# Altium schematic sheet Accelerometer.SchDoc
size 420 x 297 mm; SheetNumber: 2; SheetTotal: 14; PageSetup: Record=PageOptions|CenterHorizontal=True|CenterVertical=True|PrintScale=0.96|XCorrection=1.00|YCorrection=1.00|PrintKind=1|BorderSize=5000000|LeftOffset=0|BottomOffset=0|Orientation=2|PaperLength=4318|PaperWidth=2794|Scale=100|PaperSource=7|PrintQuality=600|MediaType=1|DitherType=10|PaperKind=11" x 17"|PrintScaleMode=1
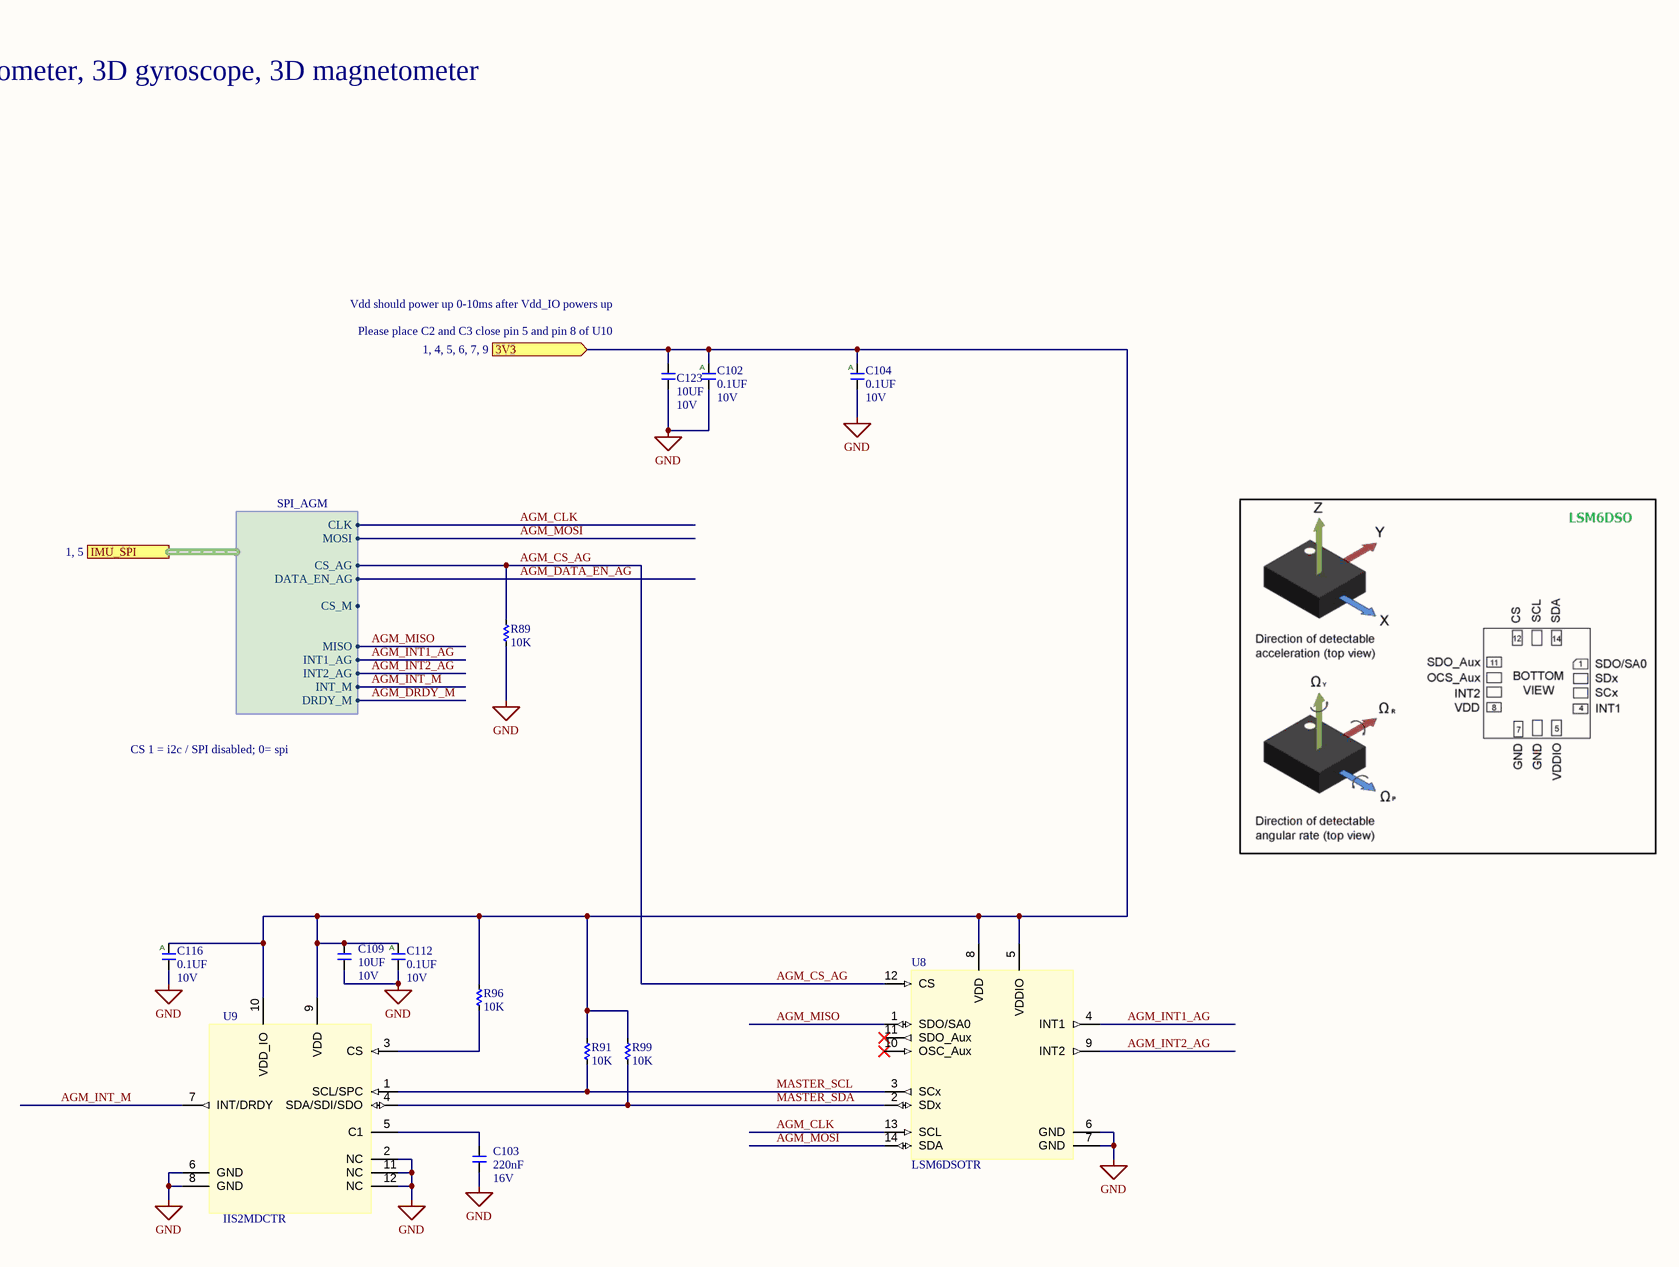
[diagram p0: Accelerometer.SchDoc]

## Parts
C102  value 0.1UF  Voltage: 10V  [C0201]  (hidden comment: __Template_Cap_Auto)
C103  value 220nF  Voltage: 16V  [C0402]  (hidden comment: __Template_Cap)
C104  value 0.1UF  Voltage: 10V  [C0201]  (hidden comment: __Template_Cap_Auto)
C109  value 10UF  Voltage: 10V  [C0402]  (hidden comment: __Template_Cap)
C112  value 0.1UF  Voltage: 10V  [C0201]  (hidden comment: __Template_Cap_Auto)
C116  value 0.1UF  Voltage: 10V  [C0201]  (hidden comment: __Template_Cap_Auto)
C123  value 10UF  Voltage: 10V  [C0402]  (hidden comment: __Template_Cap)
R89  value 10K  [R0201]  (hidden comment: __Template_Resistor)
R91  value 10K  [R0201]  (hidden comment: __Template_Resistor)
R96  value 10K  [R0201]  (hidden comment: __Template_Resistor)
R99  value 10K  [R0201]  (hidden comment: __Template_Resistor)
U8  SENSOR_ST_LSM6DSOTR  [14-LGA]  (value not drawn)
U9  SENSOR_ST_IIS2MDCTR  [12-LGA]  (value not drawn)

## Ports
3V3 (in, see 1, 4, 5, 6, 7, 9), IMU_SPI (harness SPI_AGM, see 1, 5)

## Harnesses
SPI_AGM: CLK, CS_AG, MOSI, MISO, CS_M, DATA_EN_AG, INT1_AG, INT2_AG, INT_M, DRDY_M

## Nets
GND: C102.2 C103.2 C104.2 C109.2 C112.2 C116.2 C123.2 R89.1 U8.6(GND) U8.7(GND) U9.2(NC) U9.6(GND) U9.8(GND) U9.11(NC) U9.12(NC)
3V3: C102.1 C104.1 C109.1 C112.1 C116.1 C123.1 R91.2 R96.2 R99.2 U8.5(VDDIO) U8.8(VDD) U9.9(VDD) U9.10(VDD_IO) ; port 3V3
AGM_CLK: U8.13(SCL) ; port IMU_SPI.CLK
AGM_CS_AG: R89.2 U8.12(CS) ; port IMU_SPI.CS_AG
AGM_DATA_EN_AG: port IMU_SPI.DATA_EN_AG
AGM_DRDY_M: port IMU_SPI.DRDY_M
AGM_INT1_AG: U8.4(INT1) ; port IMU_SPI.INT1_AG
AGM_INT2_AG: U8.9(INT2) ; port IMU_SPI.INT2_AG
AGM_INT_M: U9.7(INT/DRDY) ; port IMU_SPI.INT_M
AGM_MISO: U8.1(SDO/SA0) ; port IMU_SPI.MISO
AGM_MOSI: U8.14(SDA) ; port IMU_SPI.MOSI
MASTER_SCL: R91.1 U8.3(SCx) U9.1(SCL/SPC)
MASTER_SDA: R99.1 U8.2(SDx) U9.4(SDA/SDI/SDO)
NetC103_1: C103.1 U9.5(C1)
NetR96_1: R96.1 U9.3(CS)

Not connected (* = marked no-connect by the designer): U8 10(OSC_Aux)* 11(SDO_Aux)*

## Notes on the sheet
- 3D accelerometer, 3D gyroscope, 3D magnetometer
- Vdd should power up 0-10ms after Vdd_IO powers up
- Please place C2 and C3 close pin 5 and pin 8 of U10
- CS 1 = i2c / SPI disabled; 0= spi
- CREATIVE COMMONS
- PUBLIC LICENSE:
- BARKOUR ROBOT
- CC BY-NC 4.0
- APPROVED
- DWG NO
- GOOGLE LLC
- FILE
- RELEASED
- 2024/05/09
- SIZE
- 1600 AMPHITHEATRE PARKWAY
- MOUNTAIN VIEW CA 94043
- A3
- SHEET
- OF
- THIS DESIGN IS BEING PROVIDED  FOR NON-COMMERCIAL USE ONLY. THE USE OF =SCIENTIST_NAME_POSSESSIVE NAME IN CONNECTION WITH THE DESIGN IS NOT INTENDED TO IMPLY THAT =SCIENTIST_NAME SPONSORS OR ENDORSES THE DESIGN, GOOGLE LLC, OR ANY OF GOOGLE LLC'S PRODUCTS OR SERVICES.
- (in symbol 934) A

## Library data of the parts
C102 C104 C112 C116 = 934: CAP, CER, X6S, 0.1uF, 10V, 10%, 0201, AUTOGRADE; MFG: MURATA; MFG P/N: GRT033C81A104KE01D; COMMON: 150-01178-00; Status: Released; Package: 0201; Supplier 1: Digi-key; ComponentLink1URL: https://search.murata.co.jp/Ceramy/image/img/A01X/G101/ENG/GRT033C81A104KE01-01.pdf; Supplier Part Number 1: 490-12232-1-ND
C103 = 1238: CAP CER 0402 220NF 16VDC X7R; MFG: KEMET; MFG P/N: C0402C224M4RAC7867; Status: Released; Package: 0402; Supplier 1: Digi-Key; ComponentLink1URL: https://www.digikey.com/en/products/detail/murata-electronics/GRM033R61C103KA12D/4213197; Supplier Part Number 1: 399-C0402C224M4RAC7867CT-ND
C109 C123 = 215: CAP, CER, X5R, 10uF, 10V, 20%, 0402, 0.7mm T; MFG: SAMSUNG; MFG P/N: CL05A106MP5NUNC; COMMON: 150-00376-00; Status: Released; Package: 0402; Supplier 1: Digi-Key; ComponentLink1URL: https://www.digikey.com/en/products/detail/samsung-electro-mechanics/CL05A106MP5NUNC/3887108; Supplier Part Number 1: 1276-1450-1-ND
R89 R91 R96 R99 = 6783: RES, 10K, 1%, 1/20W, 0201, AUTOGRADE; MFG: PANASONIC; MFG P/N: ERJ1GNF1002C; COMMON: 470-00033-00; Status: Released; Package: 0201; Supplier 1: Digi-Key; ComponentLink1URL: https://industrial.panasonic.com/cdbs/www-data/pdf/RDA0000/AOA0000C304.pdf; Supplier Part Number 1: P122414CT-ND
U8 = LSM6DSOTR: Accelerometer, Gyroscope, 6 Axis Sensor I²C, SPI Output; Mfg: STMicroelectronics; Status: Released; Package: 14-LGA; Supplier 1: Digi-Key; ComponentLink1URL: https://www.st.com/content/ccc/resource/technical/document/datasheet/1e/3f/2a/d6/25/eb/48/46/DM00103319.pdf/files/DM00103319.pdf/jcr:content/translations/en.DM00103319.pdf; Supplier Part Number 1: 497-18181-1-ND; Mfg P/N: LSM6DSOTR; Value: LSM6DSOTR
U9 = IIS2MDCTR: SENSOR MR I2C/SPI 12LGA; Mfg: STMicroelectronics; Status: Released; Package: 12-LGA; Supplier 1: Digi-Key; ComponentLink1URL: https://www.st.com/content/ccc/resource/technical/document/datasheet/1e/3f/2a/d6/25/eb/48/46/DM00103319.pdf/files/DM00103319.pdf/jcr:content/translations/en.DM00103319.pdf; Supplier Part Number 1: 497-17728-1-ND; Value: IIS2MDCTR; Mfg P/N: IIS2MDCTR